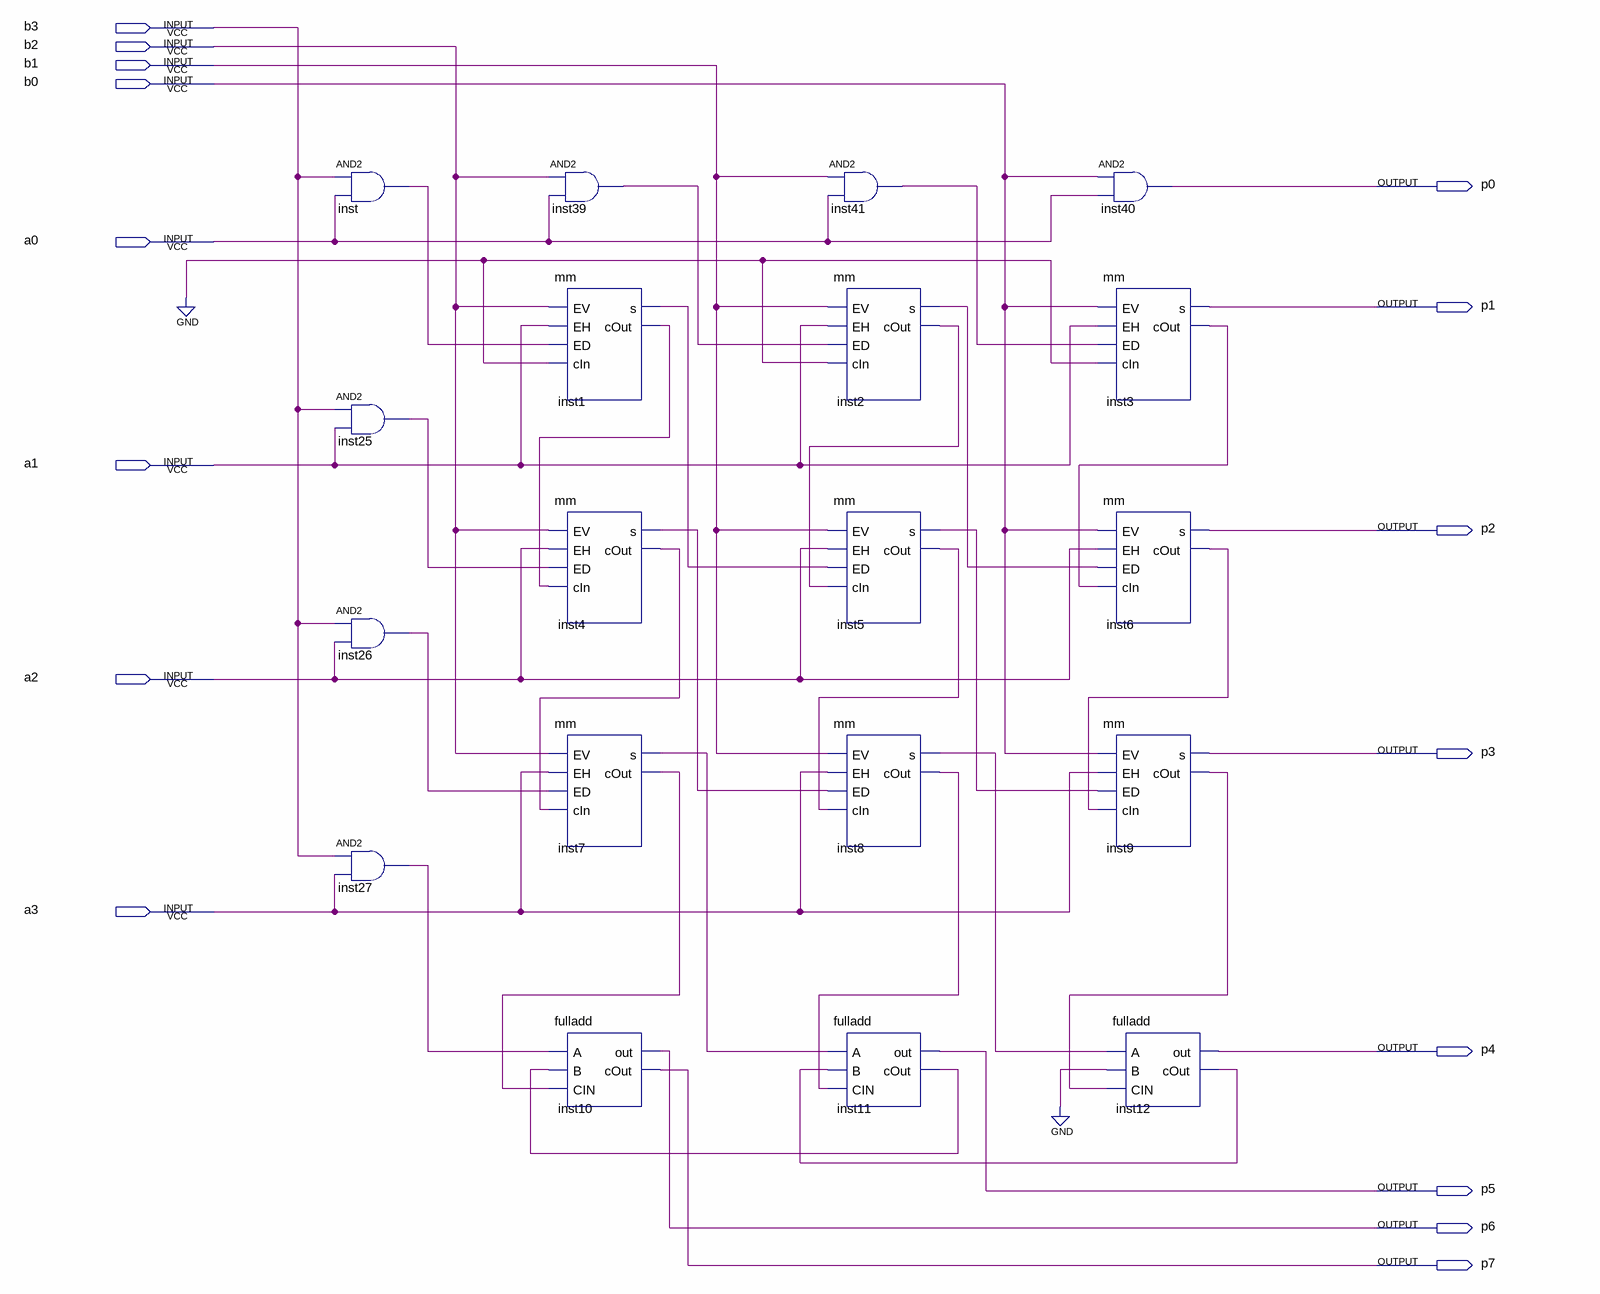
[diagram p0: schematic sheet]
// Quartus schematic mult.bdf as structural Verilog: 19 symbols, 16 pins
module mult (
  input  b3,
  input  b2,
  input  b1,
  input  b0,
  input  a0,
  input  a1,
  input  a2,
  input  a3,
  output p0,
  output p1,
  output p2,
  output p3,
  output p4,
  output p5,
  output p6,
  output p7
);

  wire inst1_cout, inst1_s, inst2_cout, inst2_s, inst3_cout, inst4_cout, inst4_s, inst5_cout, inst5_s,
       inst6_cout, inst7_cout, inst7_s, inst8_cout, inst8_s, inst9_cout, inst11_cout, inst12_cout,
       inst25_out, inst26_out, inst27_out, inst39_out, inst41_out, inst_out;

  and inst (inst_out, b3, a0);
  and inst25 (inst25_out, b3, a1);
  and inst26 (inst26_out, b3, a2);
  and inst27 (inst27_out, b3, a3);
  and inst39 (inst39_out, b2, a0);
  mm inst1 (.EV(b2), .EH(a1), .ED(inst_out), .cIn(1'b0), .s(inst1_s), .cOut(inst1_cout));
  mm inst4 (.EV(b2), .EH(a2), .ED(inst25_out), .cIn(inst1_cout), .s(inst4_s), .cOut(inst4_cout));
  mm inst7 (.EV(b2), .EH(a3), .ED(inst26_out), .cIn(inst4_cout), .s(inst7_s), .cOut(inst7_cout));
  fulladd inst10 (.A(inst27_out), .B(inst11_cout), .CIN(inst7_cout), .out(p6), .cOut(p7));
  and inst41 (inst41_out, b1, a0);
  mm inst2 (.EV(b1), .EH(a1), .ED(inst39_out), .cIn(1'b0), .s(inst2_s), .cOut(inst2_cout));
  mm inst5 (.EV(b1), .EH(a2), .ED(inst1_s), .cIn(inst2_cout), .s(inst5_s), .cOut(inst5_cout));
  mm inst8 (.EV(b1), .EH(a3), .ED(inst4_s), .cIn(inst5_cout), .s(inst8_s), .cOut(inst8_cout));
  fulladd inst11 (.A(inst7_s), .B(inst12_cout), .CIN(inst8_cout), .out(p5), .cOut(inst11_cout));
  and inst40 (p0, b0, a0);
  mm inst3 (.EV(b0), .EH(a1), .ED(inst41_out), .cIn(1'b0), .s(p1), .cOut(inst3_cout));
  mm inst6 (.EV(b0), .EH(a2), .ED(inst2_s), .cIn(inst3_cout), .s(p2), .cOut(inst6_cout));
  mm inst9 (.EV(b0), .EH(a3), .ED(inst5_s), .cIn(inst6_cout), .s(p3), .cOut(inst9_cout));
  fulladd inst12 (.A(inst8_s), .B(1'b0), .CIN(inst9_cout), .out(p4), .cOut(inst12_cout));
endmodule
